# EAGLE schematic V1 (EAGLE 7.2.0)
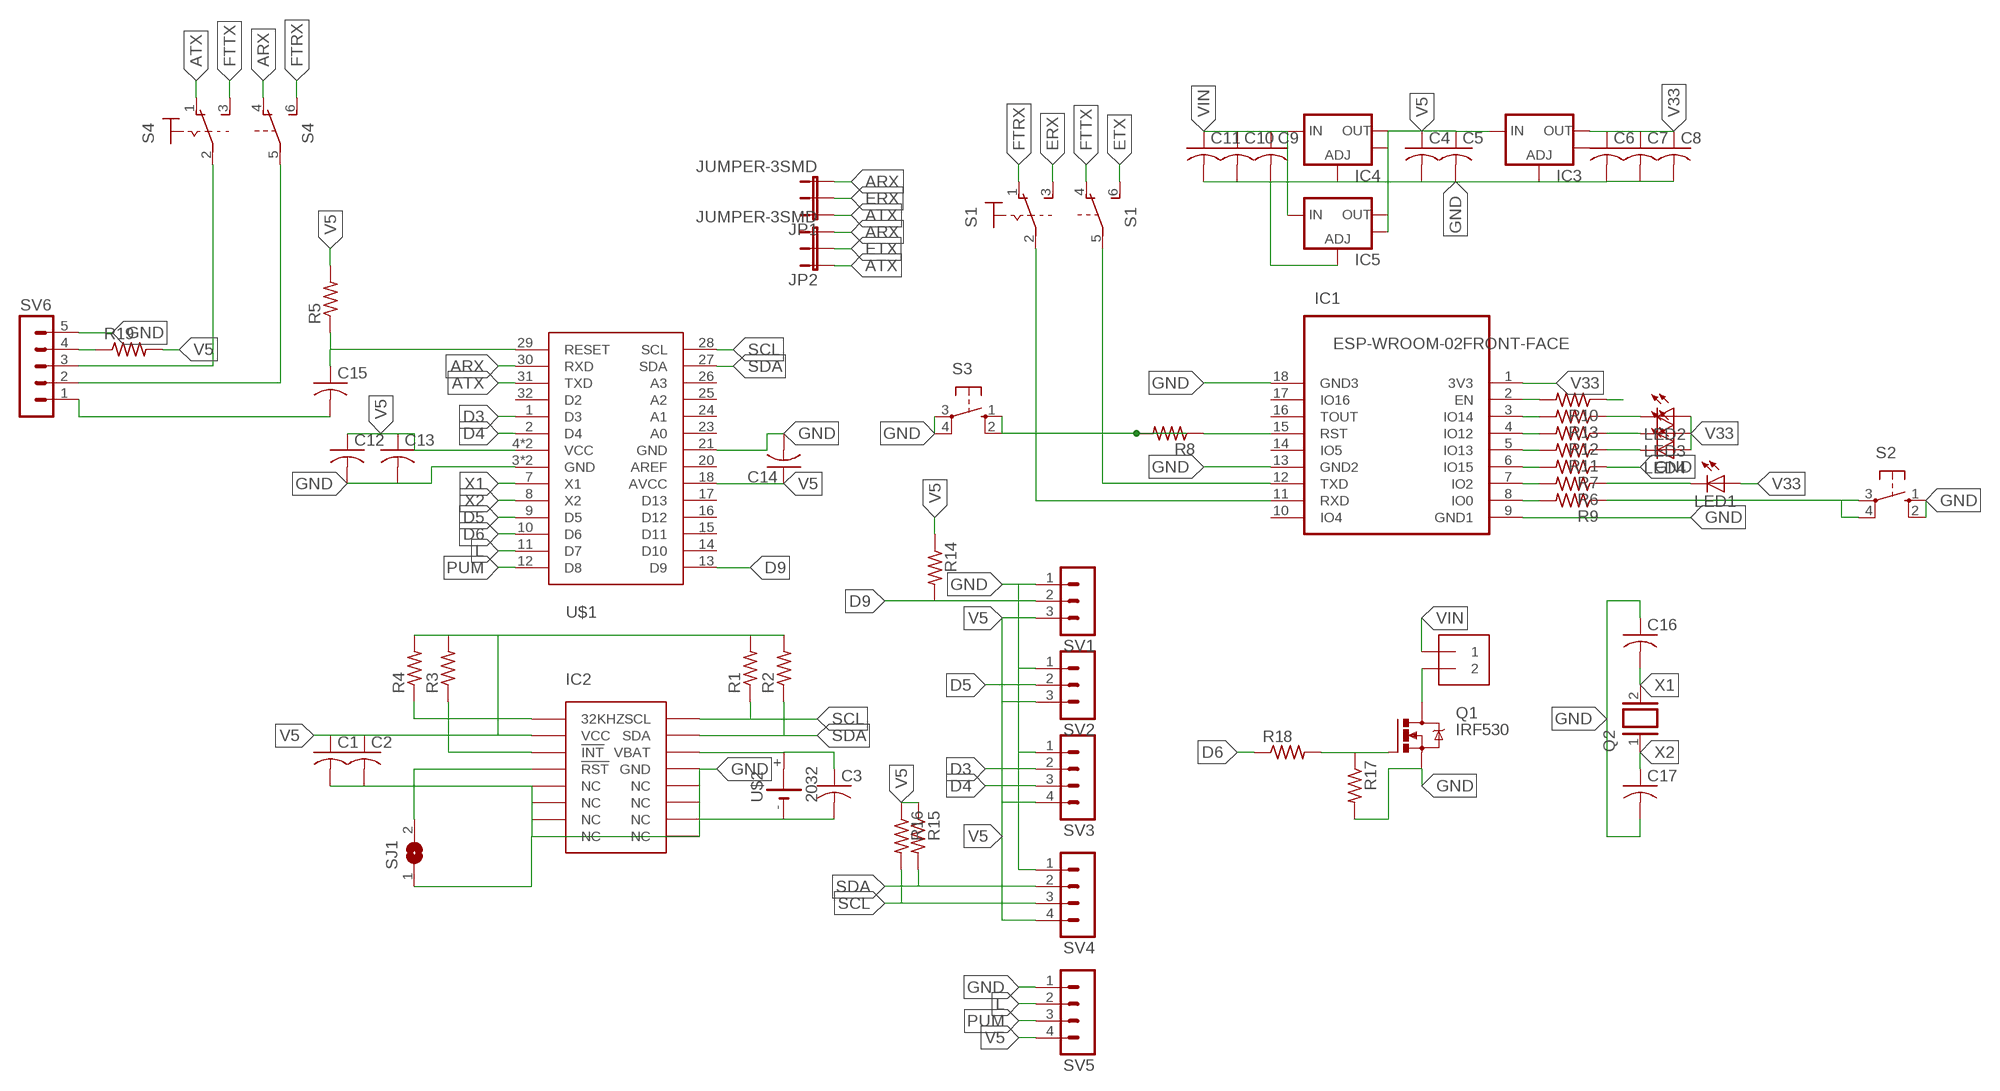
[diagram p0: schematic, sheet 1]

## Parts
C1  C-USC0805  [C0805]
C2  C-USC0805  [C0805]
C3  C-USC0805  [C0805]
C4  C-USC0805  [C0805]
C5  C-USC0805  [C0805]
C6  C-USC0805  [C0805]
C7  C-USC0805  [C0805]
C8  C-USC0805  [C0805]
C9  C-USC0805  [C0805]
C10  C-USC0805  [C0805]
C11  C-USC0805  [C0805]
C12  C-USC0805  [C0805]
C13  C-USC0805  [C0805]
C14  C-USC0805  [C0805]
C15  C-USC0805  [C0805]
C16  C-USC0805  [C0805]
C17  C-USC0805  [C0805]
IC1  ESP-WROOM-02FRONT-FACE  [FRONT-FACE]
IC2  DS3231SOIC-16W  [SOIC-16W]
IC3  V_REG_LM1117SOT223  [SOT223]
IC4  V_REG_LM1117SOT223  [SOT223]
IC5  V_REG_LM1117SOT223  [SOT223]
J1  1X2-3.5MM  [3.5MMTERM]
JP1  JUMPER-3SMD  [SJ_3]
JP2  JUMPER-3SMD  [SJ_3]
LED1  LED5MM  [LED5MM]
LED2  LED5MM  [LED5MM]
LED3  LED5MM  [LED5MM]
LED4  LED5MM  [LED5MM]
Q1  IRF530  [TO220BV]
Q2  XTAL/S  [QS]
R1  R-US_R0805  [R0805]
R2  R-US_R0805  [R0805]
R3  R-US_R0805  [R0805]
R4  R-US_R0805  [R0805]
R5  R-US_R0805  [R0805]
R6  R-US_R0805  [R0805]
R7  R-US_R0805  [R0805]
R8  R-US_R0805  [R0805]
R9  R-US_R0805  [R0805]
R10  R-US_R0805  [R0805]
R11  R-US_R0805  [R0805]
R12  R-US_R0805  [R0805]
R13  R-US_R0805  [R0805]
R14  R-US_R0805  [R0805]
R15  R-US_R0805  [R0805]
R16  R-US_R0805  [R0805]
R17  R-US_R0805  [R0805]
R18  R-US_R0805  [R0805]
R19  R-US_R0805  [R0805]
S1  320-938  [320-938]
S2  10-XX  [B3F-10XX]
S3  10-XX  [B3F-10XX]
S4  320-938  [320-938]
SJ1  SJW  [SJW]
SV1  MA03-1  [MA03-1]
SV2  MA03-1  [MA03-1]
SV3  MA04-1  [MA04-1]
SV4  MA04-1  [MA04-1]
SV5  MA04-1  [MA04-1]
SV6  MA05-1  [MA05-1]
U$1  ATMEGA328P  [TQFP32-08]
U$2  2032  [KZH20SMD]

## Nets
ARX: C15.1 JP1.3 JP2.3 R5.1 S4.4(B:O) U$1.29(RESET) U$1.30(RXD)
ATX: JP1.1 JP2.1 S4.1(1:O) U$1.31(TXD)
D3: SV3.2 U$1.1(D3)
D4: SV3.3 U$1.2(D4)
D5: SV2.2 U$1.9(D5)
D6: R18.1 U$1.10(D6)
D9: R14.2 SV1.2 U$1.13(D9)
ERX: JP1.2 S1.3(1:S)
ETX: JP2.2 S1.6(B:S)
FTRX: S1.1(1:O) S4.6(B:S)
FTTX: S1.4(B:O) S4.3(1:S)
GND: C1.2 C2.2 C3.2 C4.2 C5.2 C6.2 C7.2 C8.2 C9.2 C10.2 C11.2 C12.2 C13.2 C14.2 C16.1 C17.2 IC1.9(GND1) IC1.13(GND2) IC1.18(GND3) IC2.5(NC) IC2.6(NC) IC2.7(NC) IC2.8(NC) IC2.9(NC) IC2.10(NC) IC2.11(NC) IC2.12(NC) IC2.13(GND) IC3.1(ADJ) IC4.1(ADJ) IC5.1(ADJ) Q1.S R7.1 R17.2 S2.1(S) S2.2(S1) S3.3(P) S3.4(P1) SJ1.1 SV1.1 SV2.1 SV3.1 SV4.1 SV5.1 SV6.5 U$1.3(GND) U$1.5(GND) U$1.21(GND) U$2.-
L: SV5.2 U$1.11(D7)
N$1: IC1.11(RXD) S1.2(1:P)
N$2: C3.1 IC2.14(VBAT) U$2.+
N$3: IC1.12(TXD) S1.5(B:P)
N$4: IC1.6(IO15) R7.2
N$5: IC2.3(!INT) R3.1
N$6: IC2.4(!RST) SJ1.2
N$7: IC1.7(IO2) R6.2
N$8: IC2.1(32KHZ) R4.1
N$9: IC1.8(IO0) R9.2
N$10: IC1.15(RST) R8.1
N$11: R8.2 S3.1(S) S3.2(S1)
N$12: IC1.3(IO14) R13.2
N$13: IC1.4(IO12) R12.2
N$14: R9.1 S2.3(P) S2.4(P1)
N$15: IC1.2(EN) R10.2
N$16: R10.1
N$17: IC1.5(IO13) R11.2
N$18: LED2.K(C) R13.1
N$19: LED3.K(C) R12.1
N$20: LED4.K(C) R11.1
N$21: J1.2 Q1.D
N$22: Q1.G R17.1 R18.2
N$23: C15.2 SV6.1
N$24: S4.5(B:P) SV6.2
N$25: S4.2(1:P) SV6.3
N$26: R19.1 SV6.4
PUM: SV5.3 U$1.12(D8)
SCL: IC2.16(SCL) R1.1 R16.2 SV4.3 U$1.28(SCL)
SDA: IC2.15(SDA) R2.1 R15.2 SV4.2 U$1.27(SDA)
V5: C1.1 C2.1 C4.1 C5.1 C12.1 C13.1 C14.1 IC2.2(VCC) IC3.3(IN) IC4.2(OUT) IC4.4(OUT) IC5.2(OUT) IC5.4(OUT) R1.2 R2.2 R3.2 R4.2 R5.2 R14.1 R15.1 R16.1 R19.2 SV1.3 SV2.3 SV3.4 SV4.4 SV5.4 U$1.4(VCC) U$1.6(VCC) U$1.18(AVCC)
V33: C6.1 C7.1 C8.1 IC1.1(3V3) IC3.2(OUT) LED1.A LED1.K(C) LED2.A LED3.A LED4.A R6.1
VIN: C9.1 C10.1 C11.1 IC4.3(IN) IC5.3(IN) J1.1
X1: C16.2 Q2.2 U$1.7(X1)
X2: C17.1 Q2.1 U$1.8(X2)
Unconnected: IC1.10(IO4) IC1.14(IO5) IC1.16(TOUT) IC1.17(IO16) IC3.4(OUT) U$1.14(D10) U$1.15(D11) U$1.16(D12) U$1.17(D13) U$1.20(AREF) U$1.23(A0) U$1.24(A1) U$1.25(A2) U$1.26(A3) U$1.32(D2)

## Library data of the parts
C1-C17 = adafruit:C-US: CAPACITOR, American symbol
IC1 = esp-wroom-02:ESP-WROOM-02: WiFi module - ESP-WROOM-02
IC2 = DS3231_industrialberry:DS3231
IC3-IC5 = SparkFun:V_REG_LM1117: Voltage Regulator LM1117 Standard adjustable voltage regulator but in SMD form. Spark Fun Electronics SKU : COM-00595
J1 = adafruit:1X2: 3.5mm Terminal block http://www.ladyada.net/library/pcb/eaglelibrary.html
JP1 JP2 = SparkFun-Passives:JUMPER-3
LED1-LED4 = adafruit:LED: LED OSRAM: - CHIPLED LG R971, LG N971, LY N971, LG Q971, LY Q971, LO R971, LY R971 LH N974, LH R974 LS Q976, LO Q976, LY Q976 LO Q996 - Hyper CHIPLED LW Q18S LB Q993, LB Q99A, LB R99A - SideLED LS A670, LO A670, LY A670, LG A670, LP A670 LB A673, LV A673, LT A673, LW A673 LH A674 LY A675 LS A676, LA A676, LO A676, LY A676, LW A676 LS A679, LY A679, LG A679 - Hyper Micro SIDELED® LS Y876, LA Y876, LO Y876, LY Y876 LT Y87S - SmartLED LW L88C, LW L88S LB L89C, LB L89S, LG L890 LS L89K, LO L89K, LY L89K LS L896, LA L896, LO L896, LY L896 - TOPLED LS T670, LO T670, LY T670, LG T670, LP T670 LSG T670, LSP T670, LSY T670, LOP T670, LYG T670 LG T671, LOG T671, LSG T671 LB T673, LV T673, LT T673, LW T673 LH T674 LS T676, LA T676, LO T676, LY T676, LB T676, LH T676, LSB T676, LW T676 LB T67C, LV T67C, LT T67C, LS T67K, LO T67K, LY T67K, LW E67C LS E67B, LA E67B, LO E67B, LY E67B, LB E67C, LV E67C, LT E67C LW T67C LS T679, LY T679, LG T679 LS T770, LO T770, LY T770, LG T770, LP T770 LB T773, LV T773, LT T773, LW T773 LH T774 LS E675, LA E675, LY E675, LS T675 LS T776, LA T776, LO T776, LY T776, LB T776 LHGB T686 LT T68C, LB T68C - Hyper Mini TOPLED® LB M676 - Mini TOPLED Santana® LG M470 LS M47K, LO M47K, LY M47K Source: http://www.osram.convergy.de/
Q1 = transistor-power:IRF530: HEXFET Power MOSFET
Q2 = special:XTAL/S: CRYSTAL
R1-R19 = adafruit:R-US_: RESISTOR, American symbol
S1 S4 = switch:320-938: TOGGLE SWITCH distributor RS Components
S2 S3 = switch-omron:10-XX: OMRON SWITCH; MPN: B3F-1000; OC_FARNELL: 176432; OC_NEWARK: 36M3542
SJ1 = jumper:SJ: SMD solder JUMPER
SV1 SV2 = con-lstb:MA03-1: PIN HEADER
SV3-SV5 = con-lstb:MA04-1: PIN HEADER
SV6 = con-lstb:MA05-1: PIN HEADER; OC_FARNELL: unknown; OC_NEWARK: unknown
U$1 = lightsuits:ATMEGA328P
U$2 = kzh20_lithium_batterie_holder:2032